# EAGLE design Adafruit PiUART USB Micro (EAGLE 6.6.0)
COMPANY: ADAFRUIT INDUSTRIES; DRAWN: KTOWN; REV: A
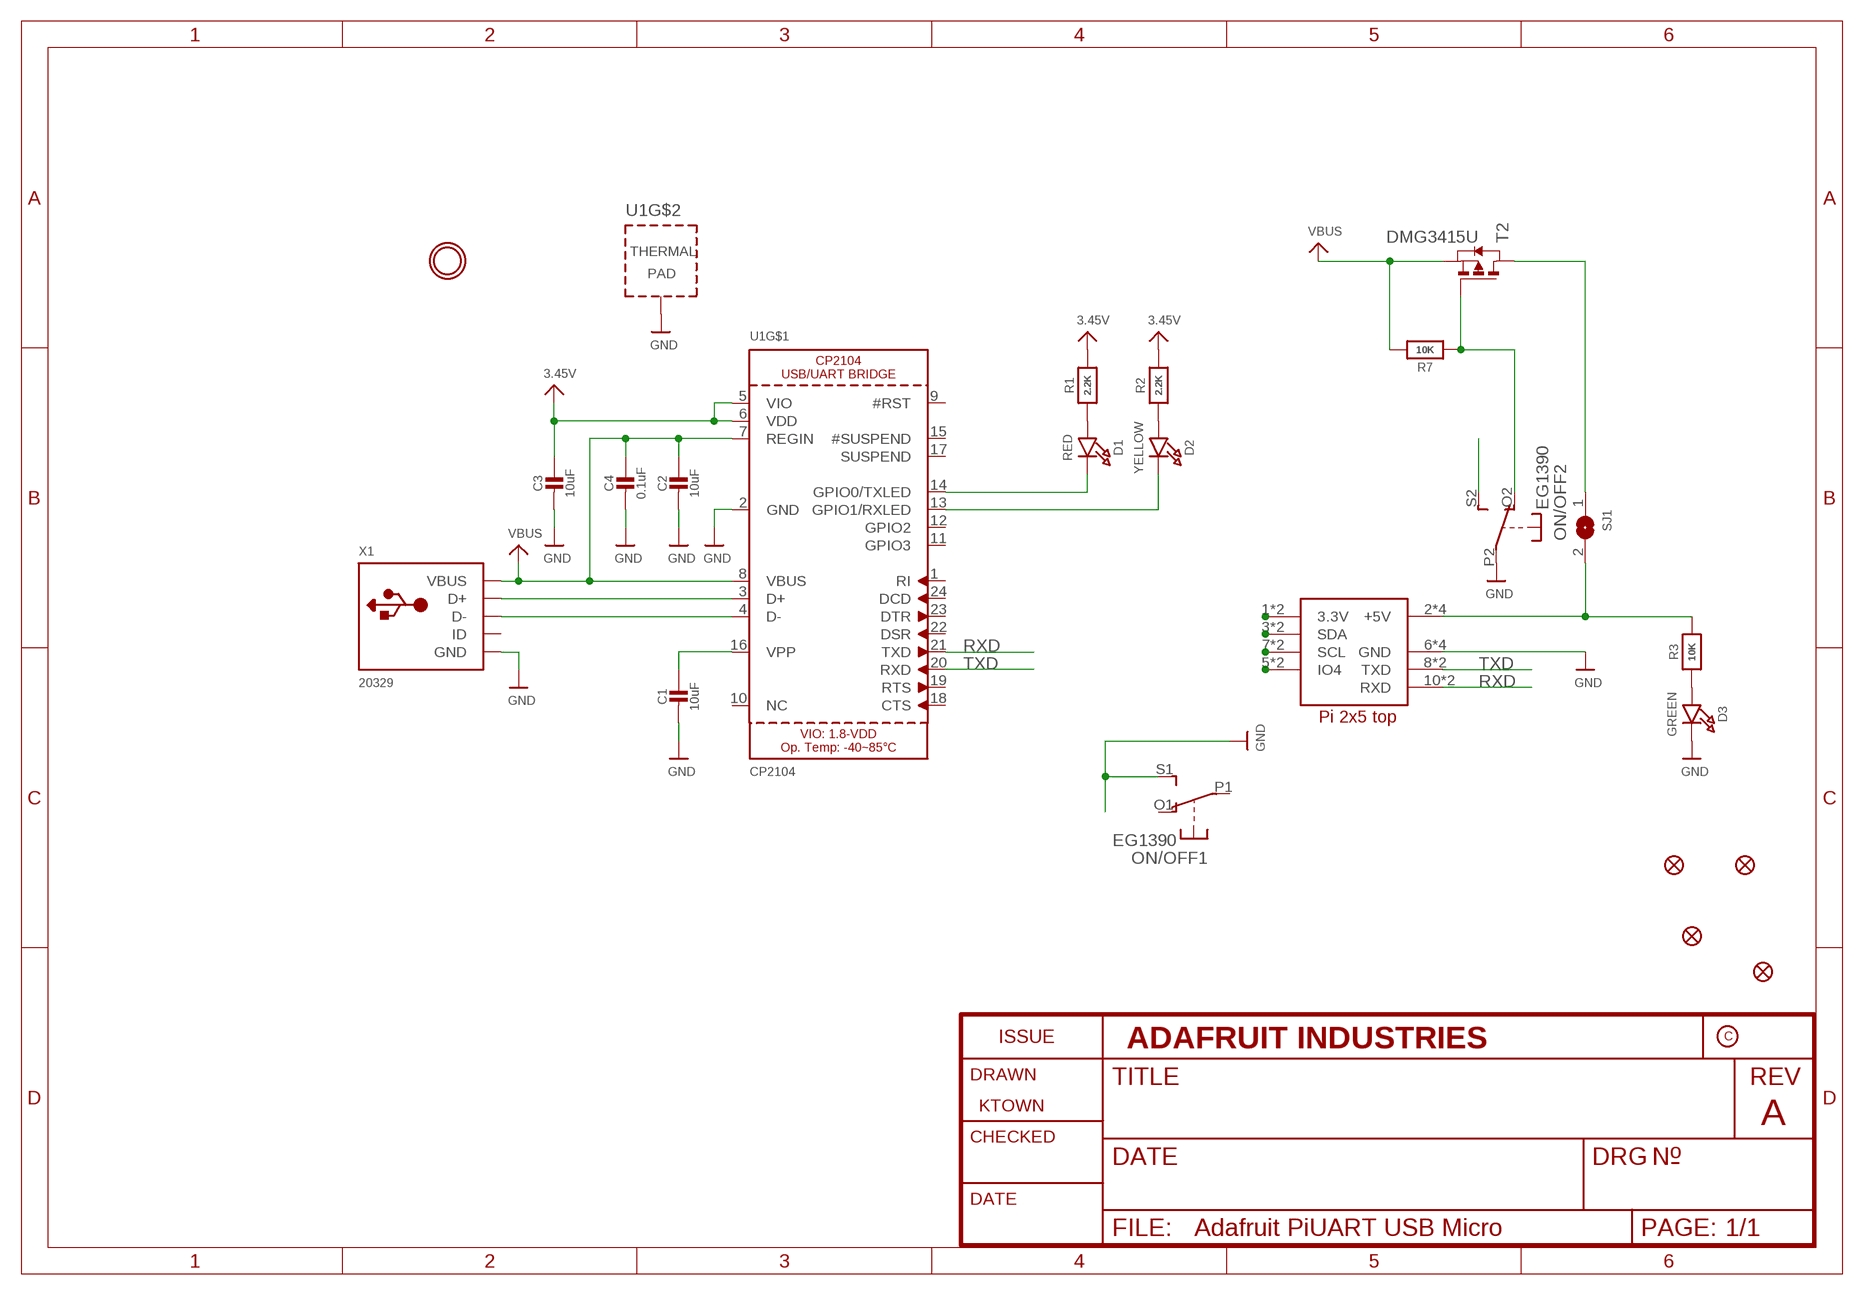
[diagram p0: schematic, sheet 1]

## Parts
C1  10uF  CAP_CERAMIC0805-NOOUTLINE  [0805-NO]
C2  10uF  CAP_CERAMIC0805-NOOUTLINE  [0805-NO]
C3  10uF  CAP_CERAMIC0805-NOOUTLINE  [0805-NO]
C4  0.1uF  CAP_CERAMIC0603_NO  [0603-NO]
D1  RED  LED0603_NOOUTLINE  [CHIPLED_0603_NOOUTLINE]
D2  YELLOW  LED0603_NOOUTLINE  [CHIPLED_0603_NOOUTLINE]
D3  GREEN  LED0603_NOOUTLINE  [CHIPLED_0603_NOOUTLINE]
FID1  FIDUCIAL_1MM  [FIDUCIAL_1MM]
FID2  FIDUCIAL_1MM  [FIDUCIAL_1MM]
FID3  FIDUCIAL_1MM  [FIDUCIAL_1MM]
FID4  FIDUCIAL_1MM  [FIDUCIAL_1MM]
ON/OFF  EG1390  DPDT-EG1390  [EG1390]
R1  2.2K  RESISTOR_0603_NOOUT  [0603-NO]
R2  2.2K  RESISTOR_0603_NOOUT  [0603-NO]
R3  10K  RESISTOR_0603_NOOUT  [0603-NO]
R7  10K  RESISTOR_0603_NOOUT  [0603-NO]
SJ1  SOLDERJUMPERCLOSED  [SOLDERJUMPER_CLOSEDWIRE]
T2  DMG3415U  PMOSSOT23  [SOT-23]
U1  CP2104  [QFN24_4MM_SMSC]
U$9  RASPBERRYPI_2X5  [RASPBERRYPI_2X5_THMSMT]
U$18  MOUNTINGHOLE3.0THIN  [MOUNTINGHOLE_3.0_PLATEDTHIN]
X1  20329  USB_MICRO_20329_V2  [4UCONN_20329_V2]

## Nets
3.3V: C3.1 R1.2 R2.2 U1.5(VIO) U1.6(VDD) ; supply symbol labelled 3.45V
GND: C1.2 C2.2 C3.2 C4.2 D3.C ON/OFF.P2(2:P) ON/OFF.S1(1:S) U1.2(GND) U1.THERM(TP) U$9.6'(GND) U$9.6(GND) U$9.9'(GND) U$9.9(GND) X1.BASE@1(GND) X1.BASE@2(GND) X1.GND X1.SPRT@1(GND) X1.SPRT@2(GND) X1.SPRT@3(GND) X1.SPRT@4(GND)
N$1: D1.A R1.1
N$2: U1.3(D+) X1.D+
N$3: U1.4(D-) X1.D-
N$4: C1.1 U1.16(VPP)
N$5: D2.A R2.1
N$6: D1.C U1.14(GPIO0/TXLED)
N$7: D2.C U1.13(GPIO1/RXLED)
N$8: U$9.1'(3.3V) U$9.1(3.3V)
N$9: U$9.3'(SDA) U$9.3(SDA)
N$10: U$9.7'(SCL) U$9.7(SCL)
N$11: U$9.5'(IO4) U$9.5(IO4)
N$12: R3.2 SJ1.2 U$9.2'(+5V) U$9.2(+5V) U$9.4'(+5V) U$9.4(+5V)
N$13: ON/OFF.O2(2:O) R7.1 T2.3(G)
N$14: ON/OFF.S2(2:S)
N$15: D3.A R3.1
RXD: U1.21(TXD) U$9.10'(RXD) U$9.10(RXD)
TXD: U1.20(RXD) U$9.8'(TXD) U$9.8(TXD)
VBUS: C2.1 C4.1 R7.2 T2.2(S) U1.7(REGIN) U1.8(VBUS) X1.VBUS
VIN [power]: SJ1.1 T2.1(D)
Unconnected: ON/OFF.O1(1:O) ON/OFF.P1(1:P) U1.1(RI) U1.9(#RST) U1.10(NC) U1.11(GPIO3) U1.12(GPIO2) U1.15(#SUSPEND) U1.17(SUSPEND) U1.18(CTS) U1.19(RTS) U1.22(DSR) U1.23(DTR) U1.24(DCD) X1.ID

## Library data of the parts
C1-C4 = microbuilder:CAP_CERAMIC: Ceramic Capacitors For new designs, use the packages preceded by an '_' character since they are more reliable: The following footprints should be used on most boards: _0402 - Standard footprint for regular board layouts _0603 - Standard footprint for regular board layouts _0805 - Standard footprint for regular board layouts _1206 - Standard footprint for regular board layouts For extremely tight-pitch boards where space is at a premium, the following 'micro-pitch' footprints can be used (smaller pads, no silkscreen outline, etc.): _0402MP - Micro-pitch footprint for very dense/compact boards _0603MP - Micro-pitch footprint for very dense/compact boards _0805MP - Micro-pitch footprint for very dense/compact boards _1206MP - Micro-pitch footprint for very dense/compact boards
D1-D3 = microbuilder:LED: LED 0603 - 0603 Surface Mount Package 2mA: Green LED - Low Power (3.9mcd, 2ma, 1.7Vf) - Digikey: 475-2709-2-ND Orange LED - Low Power (9.8mcd, 2ma, 1.8Vf) - Digikey: 475-1194-2-ND Red LED - Low Power (5mcd, 2ma, 1.8Vf) - Digikey: 475-1195-2-ND Yellow LED - Low Power (7mcd, 2ma, 1.8Vf) - Digikey: 475-1196-2-ND 5mA: Blue LED - Low Power (17mcd, 5ma, 2.9Vf) - Digikey: LNJ937W8CRACT-ND 0805 - 0805 Surface Mount Package 2mA: Red LED (8.8mcd, 2mA, 1.8Vf, Clear) - Low Power [Digikey: 475-2510-1-ND] Green LED (5mcd, 2mA, 1.8Vf, Clear) - Low Power [Digikey: 475-2730-1-ND] Yellow LED (11.3mcd, 2mA, 1.8Vf, Clear) - Low Power [Digikey: 475-2555-1-ND] 20mA: Red LED (104mcd, 20mA, Diffused) - LS R976 [Digikey: 475-1278-6-ND] Red LED (12mcd, 20mA, 2.0Vf, Clear) - APT2012EC [Digikey: 754-1128-1-ND] Green LED (15mcd, 20mA, 2.2Vf, Clear) - APT2012GC [Digikey: 754-1131-1-ND] Orange LED (160mcd, 20mA, 2.1Vf, Clear) - APT2012SECK [Digikey: 754-1130-1-ND] 1206 - 1206 Surface Mount Package Green LED (26mcd, 20mA, Diffused) - LG N971 [Digikey: 475-1407-6-ND] Red LED (15mcd, 20mA, Diffused) - LH N974 [Digikey: 475-1416-6-ND] Cree - Cree High-Power Surface Mount LEDs XPEBWT-L1-0000-00D50 - White 111lm 350mA 2.9Vf 6200K 110° XTEAWT-00-0000-00000LEE3 - White 114lm 350mA 2.85Vf 5000K 115° Everlight - Everlight 45-21 Series Surface Mount LEDs 45-21/QK2C-B2832AC2CB2/2T - Warm White 2000mcd 20mA 3.25Vf 3050K 120° 45-21/LK2C-B38452C4CB2/2T - Nuetral White 2000mcd 20mA 3.25Vf 4150K 120° 45-21/LK2C-B50634C6CB2/2T - Cold White 2200mcd 20mA 3.25Vf 5650K 120° PLCC2 Reverse Mount LS T77K-J1L2-1-0-2-R18-Z - Red 11.25mcd 2mA 1.8Vf 630nm 120° LO T77K-L1M2-24-Z - Orange 19.6mcd 2mA 1.8Vf 606nm 120° LY T77K-K2M1-26-Z - Yellow 15.7mcd 2mA 1.8Vf 587nm 120°
FID1-FID4 = microbuilder:FIDUCIAL: Fiducial Alignment Points Various fiducial points for machine vision alignment.; BOM: EXCLUDE
ON/OFF = adafruit:DPDT
R1-R3 R7 = microbuilder:RESISTOR: Resistors For new designs, use the packages preceded by an '_' character since they are more reliable: The following footprints should be used on most boards: _0402 - Standard footprint for regular board layouts _0603 - Standard footprint for regular board layouts _0805 - Standard footprint for regular board layouts _1206 - Standard footprint for regular board layouts For extremely tight-pitch boards where space is at a premium, the following 'micro-pitch' footprints can be used (smaller pads, no silkscreen outline, etc.): _0402MP - Micro-pitch footprint for very dense/compact boards _0603MP - Micro-pitch footprint for very dense/compact boards _0805MP - Micro-pitch footprint for very dense/compact boards _1206MP - Micro-pitch footprint for very dense/compact boards
SJ1 = microbuilder:SOLDERJUMPER: SMD Solder JUMPER Solder the two pads together to create a connection, or remove the solder to break it. REFLOW - Use this footprint for solder paste and reflow ovens. WAVE - Use this footprint for hand-soldering (larger pads). CLOSED - Has a trace between the two pads to ensure it is closed by default. The trace needs to be cut to disable the jumper, and can be closed again by creating a solder bridge between the two pads.
T2 = zetex:PMOSSOT23: MOS FET; OC_FARNELL: unknown; OC_NEWARK: unknown
U1 = microbuilder:CP2104: CP2104 - USB to UART Bridge VDD Output: 3.45V
U$9 = microbuilder:RASPBERRYPI_2X5
U$18 = microbuilder:MOUNTINGHOLE: Mounting Hole For #2 screws (0.086"/2.18mm width, 0.094"/2.4mm hole) use 2.5mm; BOM: EXCLUDE
X1 = microbuilder:USB: USB Connectors USBMINIB - Surface Mount Female Mini-B USB Connector 4UConnector: 06564

## Net classes
1 power: width 0.305 mm, drill 0.483 mm, clearance 0.203 mm
2 gnd: width 0.305 mm, drill 0.483 mm, clearance 0.203 mm

## Board
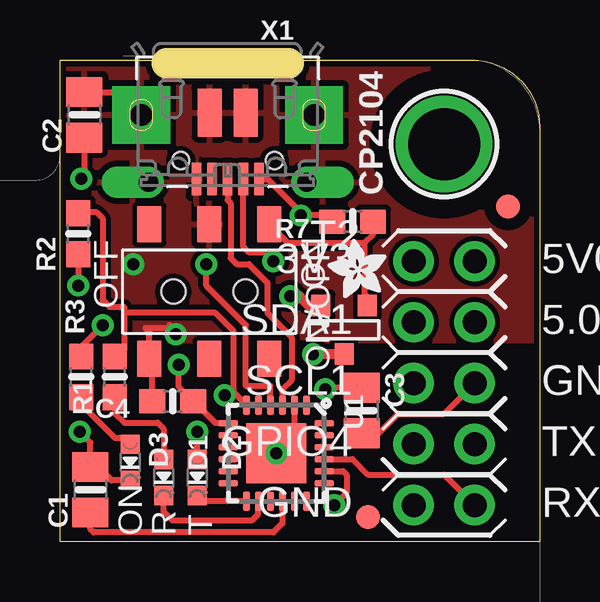
[diagram p1: board, top side]
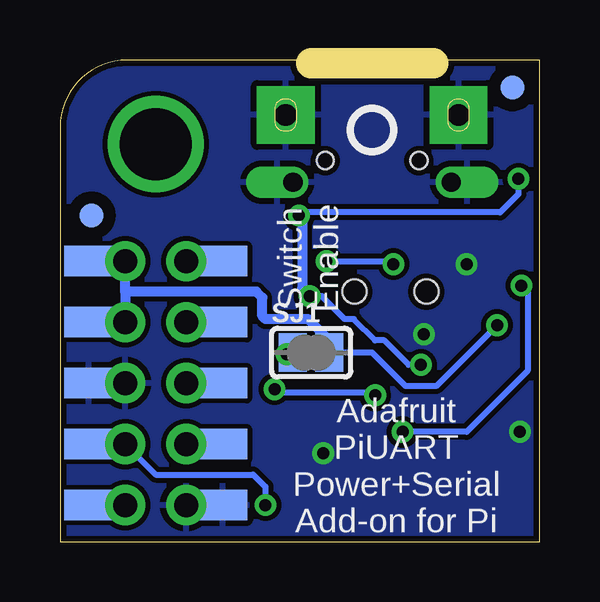
[diagram p2: board, bottom side, seen from below]

Size 19.99 x 20.07 mm. Coordinates in mm from the lower left corner, seen from the top.
Outline: 4.45,19.94 9.53,19.94
Outline: 0,20.07 17.2,20.07 arc-90 19.99,17.27 19.99,0 0,0 0,20.07
Copper layers (1*16): Top 0.035mm / dielectric 1.5mm / Bottom 0.035mm
Design rules "adafruit *": minimum track width 8mil, minimum drill 15.5mil, track to track 8mil, track to pad 8mil, pad to pad 8mil, via to via 8mil, smd to smd 8mil, copper to edge 10mil, drill to drill 8mil, minimum pad ring 10mil, minimum via ring 8mil, stop-mask expansion 2mil, vias tented up to drill 20mil, thermal gap 10mil

### Footprints (pad centres in the part's own frame; a part is rotated, then mirrored left to right if it is on the bottom)
0805-NO = smd 1.24 x 1.5: 1 -0.95,0; 2 0.95,0
0603-NO = smd 1.075 x 1: 1 -0.85,0; 2 0.85,0
CHIPLED_0603_NOOUTLINE = smd 0.8 x 0.8: A 0,-0.75; C 0,0.75
FIDUCIAL_1MM = smd 1 x 1: 1 0,0
EG1390 = smd 1 x 1.5: O1 -2.5,2.8; O2 -2.5,-2.8; P1 0,2.8; P2 0,-2.8; S1 2.5,2.8; S2 2.5,-2.8 | hole 1: 1.5,0; -1.5,0
SOLDERJUMPER_CLOSEDWIRE = smd 1.168 x 1.6: 1 -0.762,0; 2 0.762,0 | smd 0.635 x 0.203: WIRE 0,0
SOT-23 = smd 0.787 x 0.889: 1 0.025,-1.016; 2 -0.94,1.016; 3 0.991,1.016
QFN24_4MM_SMSC = smd 0.8 x 0.28: 1 -2,1.25; 2 -2,0.75; 3 -2,0.25; 4 -2,-0.25; 5 -2,-0.75; 6 -2,-1.25; 13 2,-1.25; 14 2,-0.75; 15 2,-0.25; 16 2,0.25; 17 2,0.75; 18 2,1.25 | smd 0.28 x 0.8: 7 -1.25,-2; 8 -0.75,-2; 9 -0.25,-2; 10 0.25,-2; 11 0.75,-2; 12 1.25,-2; 19 1.25,2; 20 0.75,2; 21 0.25,2; 22 -0.25,2; 23 -0.75,2; 24 -1.25,2 | smd 2.5 x 2.5: THERM 0,0
RASPBERRYPI_2X5_THMSMT = drill 1 pad 1.676: 1 -1.27,5.08; 2 1.27,5.08; 3 -1.27,2.54; 4 1.27,2.54; 5 -1.27,0; 6 1.27,0; 7 -1.27,-2.54; 8 1.27,-2.54; 9 -1.27,-5.08; 10 1.27,-5.08 | smd 2.032 x 1.27 bottom: 1' -2.794,5.08; 2' 2.794,5.08; 3' -2.794,2.54; 4' 2.794,2.54; 5' -2.794,0; 6' 2.794,0; 7' -2.794,-2.54; 8' 2.794,-2.54; 9' -2.794,-5.08; 10' 2.794,-5.08
MOUNTINGHOLE_3.0_PLATEDTHIN = drill 3 pad 3.6: P$1 0,0
4UCONN_20329_V2 = smd 1 x 2: BASE@1 -0.75,-2; BASE@2 0.75,-2 | smd 0.4 x 1.35: D+ 0,0.775; D- -0.65,0.775; GND 1.3,0.775; ID 0.65,0.775; VBUS -1.3,0.775 | drill 0.8 pad 1.143 offset: SPRT@1 -3.3,0.9; SPRT@2 3.3,0.9 | drill 0.9 pad 2.413 square: SPRT@3 -3.6,-1.9; SPRT@4 3.6,-1.9 | hole 0.7: -1.95,0; 1.95,0

### Placement (x,y rotation side)
C1  1.27,2.16 90 top
C2  1.02,17.78 90 top
C3  12.57,5.46 270 top
C4  4.7,5.84 180 top
D1  4.32,2.67 180 top
D2  5.71,2.67 180 top
D3  2.92,3.3 180 top
FID1  12.83,1.02 0 top
FID2  18.67,13.97 0 top
FID3  18.67,13.59 0 bottom
FID4  1.14,18.92 0 bottom
ON/OFF  6.22,10.41 180 top
R1  2.29,6.86 90 top
R2  0.76,12.83 90 top
R3  0.89,6.86 90 top
R7  12.19,13.34 180 top
SJ1  9.53,7.87 0 bottom
T2  11.81,8.83 0 top
U1  9.02,3.68 270 top
U$8  [ADAFRUIT_2.5MM]  13.59,10.16 90 top
U$9  16,6.6 0 top
U$17  [PCBFEAT-REV-040]  6.99,17.14 0 bottom
U$18  16,16.56 0 top
X1  6.99,15.88 180 top

### Tracks (layer width: path | path; a pad name or v marks a point on that pad's centre or on a via)
3.3V  (via drill 0.5)
  Top 0.254: U1.5 U1.6 | U1.6 | U1.6 7.24,6.22 | 7.24,6.22 7.24,8.76 6.48,9.53 2.67,9.53 | 7.24,6.22 6.86,6.22 v6.86,6.1 | C3.1 11.11,6.41 v11.05,6.35 | 2.67,9.53 2.67,9.78 2.07,9.78 1.78,10.07 1.78,13.46 1.52,13.72 0.8,13.72 R2.2 | 2.67,9.53 2.67,7.96 2.54,7.96 R1.2
  Bottom 0.254: v11.05,6.35 10.92,6.22 6.86,6.22 v6.86,6.1
GND  (via drill 0.5)
  Top 0.254: U1.2 9.77,4.56 9.02,3.81 U1.THERM | C3.2 13.27,4.51 14.1,5.33 16,5.33 U$9.6 | v0.83,4.57 1.27,4.13 C1.2 1.59,3.11 2.15,2.55 D3.C | ON/OFF.S1 3.56,7.78 | v4.83,8.64 4.57,8.89 4.57,9.02 4.45,8.89 3.56,8.89 3.72,8.72 ON/OFF.S1 | C2.2 2.43,18.73 X1.SPRT@4 | C4.2 3.85,7.49 ON/OFF.S1
  Bottom 0.254: U$9.9' U$9.9 | U$9.6' U$9.6
  other vias: 9.02,3.68 3.05,11.56
  pour Bottom: 0,20.07 0,0.25 20.07,0.25 20.07,17.27 arc90 17.27,20.07
  pour Top: 0.13,20.07 0.13,8.38 20.07,8.38 20.07,20.07
N$1
  Top 0.254: D1.A 4.32,4.7 4.06,4.95 2.67,4.95 2.29,5.33 R1.1
N$2
  Top 0.254: U1.3 9.27,6.35 9.65,6.73 9.65,8.51 8.64,9.53 8.64,10.79 7.87,11.56 7.37,11.56 7.11,11.81 7.11,14.1 6.99,14.22 X1.D+
N$3  (via drill 0.5)
  Top 0.254: U1.4 8.77,6.47 8.76,6.48 7.75,6.48 7.75,9.02 6.1,10.67 v6.1,11.56 | v8.89,11.68 8.51,12.06 7.87,12.06 7.62,12.32 7.62,15.09 X1.D-
  Bottom 0.254: v8.89,11.68 6.1,11.68 v6.1,11.56
N$4
  Top 0.254: U1.16 9.27,0.76 8.89,0.38 1.4,0.38 1.27,0.51 C1.1
N$5  (via drill 0.5)
  Top 0.254: D2.A v5.71,4.57 | R2.1 v0.76,10.67
  Bottom 0.254: v0.76,10.67 0.51,10.41 0.51,7.11 3.05,4.57 v5.71,4.57
N$6
  Top 0.254: U1.14 8.26,1.67 8.26,1.14 8,0.89 4.67,0.89 4.32,1.24 D1.C
N$7
  Top 0.254: U1.13 5.95,1.68 D2.C
N$8
  Bottom 0.254: U$9.1' U$9.1
N$9
  Bottom 0.254: U$9.3' U$9.3
N$10
  Bottom 0.254: U$9.7' U$9.7
N$11
  Bottom 0.254: U$9.5' U$9.5
N$12  (via drill 0.5)
  Top 0.254: R3.2 0.89,8.13 v1.78,9.02
  Bottom 0.254: 8.38,7.87 SJ1.2 6.99,7.87 5.59,6.48 4.32,6.48 v1.78,9.02
  Bottom 0.406: SJ1.2 8.76,8.38 9.65,9.27 11.43,9.27 11.56,9.4 11.56,10.16 11.81,10.41 17.27,10.41 | 17.27,10.41 U$9.2 U$9.2' | 17.27,10.41 U$9.4 U$9.4'
N$13
  Top 0.254: 12.8,9.5 T2.3 12.8,10.2 12.7,10.3 12.7,12.45 | ON/OFF.O2 9.49,12.45 12.7,12.45 | 12.7,12.45 13.04,12.79 R7.1
N$15
  Top 0.254: R3.1 1.02,5.88 1.02,5.59 2.29,4.32 2.65,4.32 D3.A
RXD
  Top 0.254: U1.21 12.19,3.43 12.83,2.79 16,2.79 U$9.10
  Bottom 0.254: U$9.10' U$9.10
TXD  (via drill 0.5)
  Top 0.254: U1.20 11.8,2.93 11.94,2.79 11.94,2.03 v11.43,1.52
  Bottom 0.254: U$9.8' U$9.8 16,2.79 11.94,2.79 11.43,2.29 v11.43,1.52
VBUS  (via drill 0.5)
  Top 0.254: U1.8 U1.7 6.5,4.93 5.97,5.46 5.93,5.46 C4.1 4.95,6.44 v4.95,7.37 | 10.48,9.84 T2.2 | C2.1 1.02,15.24 v0.89,15.11 | X1.VBUS 8.65,15.1 10.16,13.59 v10.03,13.59 11.09,13.59 R7.2
  Top 0.406: v9.59,10.22 9.97,10.22 10.35,9.84 T2.2
  Bottom 0.254: 9.84,10.22 v9.59,10.22 9.08,10.22 8.13,9.27 7.75,9.27 6.86,8.38 6.48,8.38 5.46,7.37 v4.95,7.37 | v0.89,15.11 0.89,14.48 1.65,13.72 9.91,13.72 v10.03,13.59
  Bottom 0.406: v10.03,13.59 9.84,13.4 9.91,13.34 9.91,10.54 v9.59,10.22
VIN  (via drill 0.5)
  Top 0.406: 11.84,7.87 T2.1 v10.54,7.81
  Bottom 0.406: SJ1.1 10.35,7.81 v10.54,7.81

### Text on the board
tPlace: CP2104 | OFF | ON | ON | R | T
bPlace: Switch / Enable | Adafruit / PiUART / Power+Serial / Add-on for Pi